# Altium schematic sheet DRAM DDR4.SchDoc (part 1 of 2)
size 594 x 420 mm; Author: ALTIUM GOSTBOM2.0 KEV; SheetNumber: 8; SheetTotal: 48
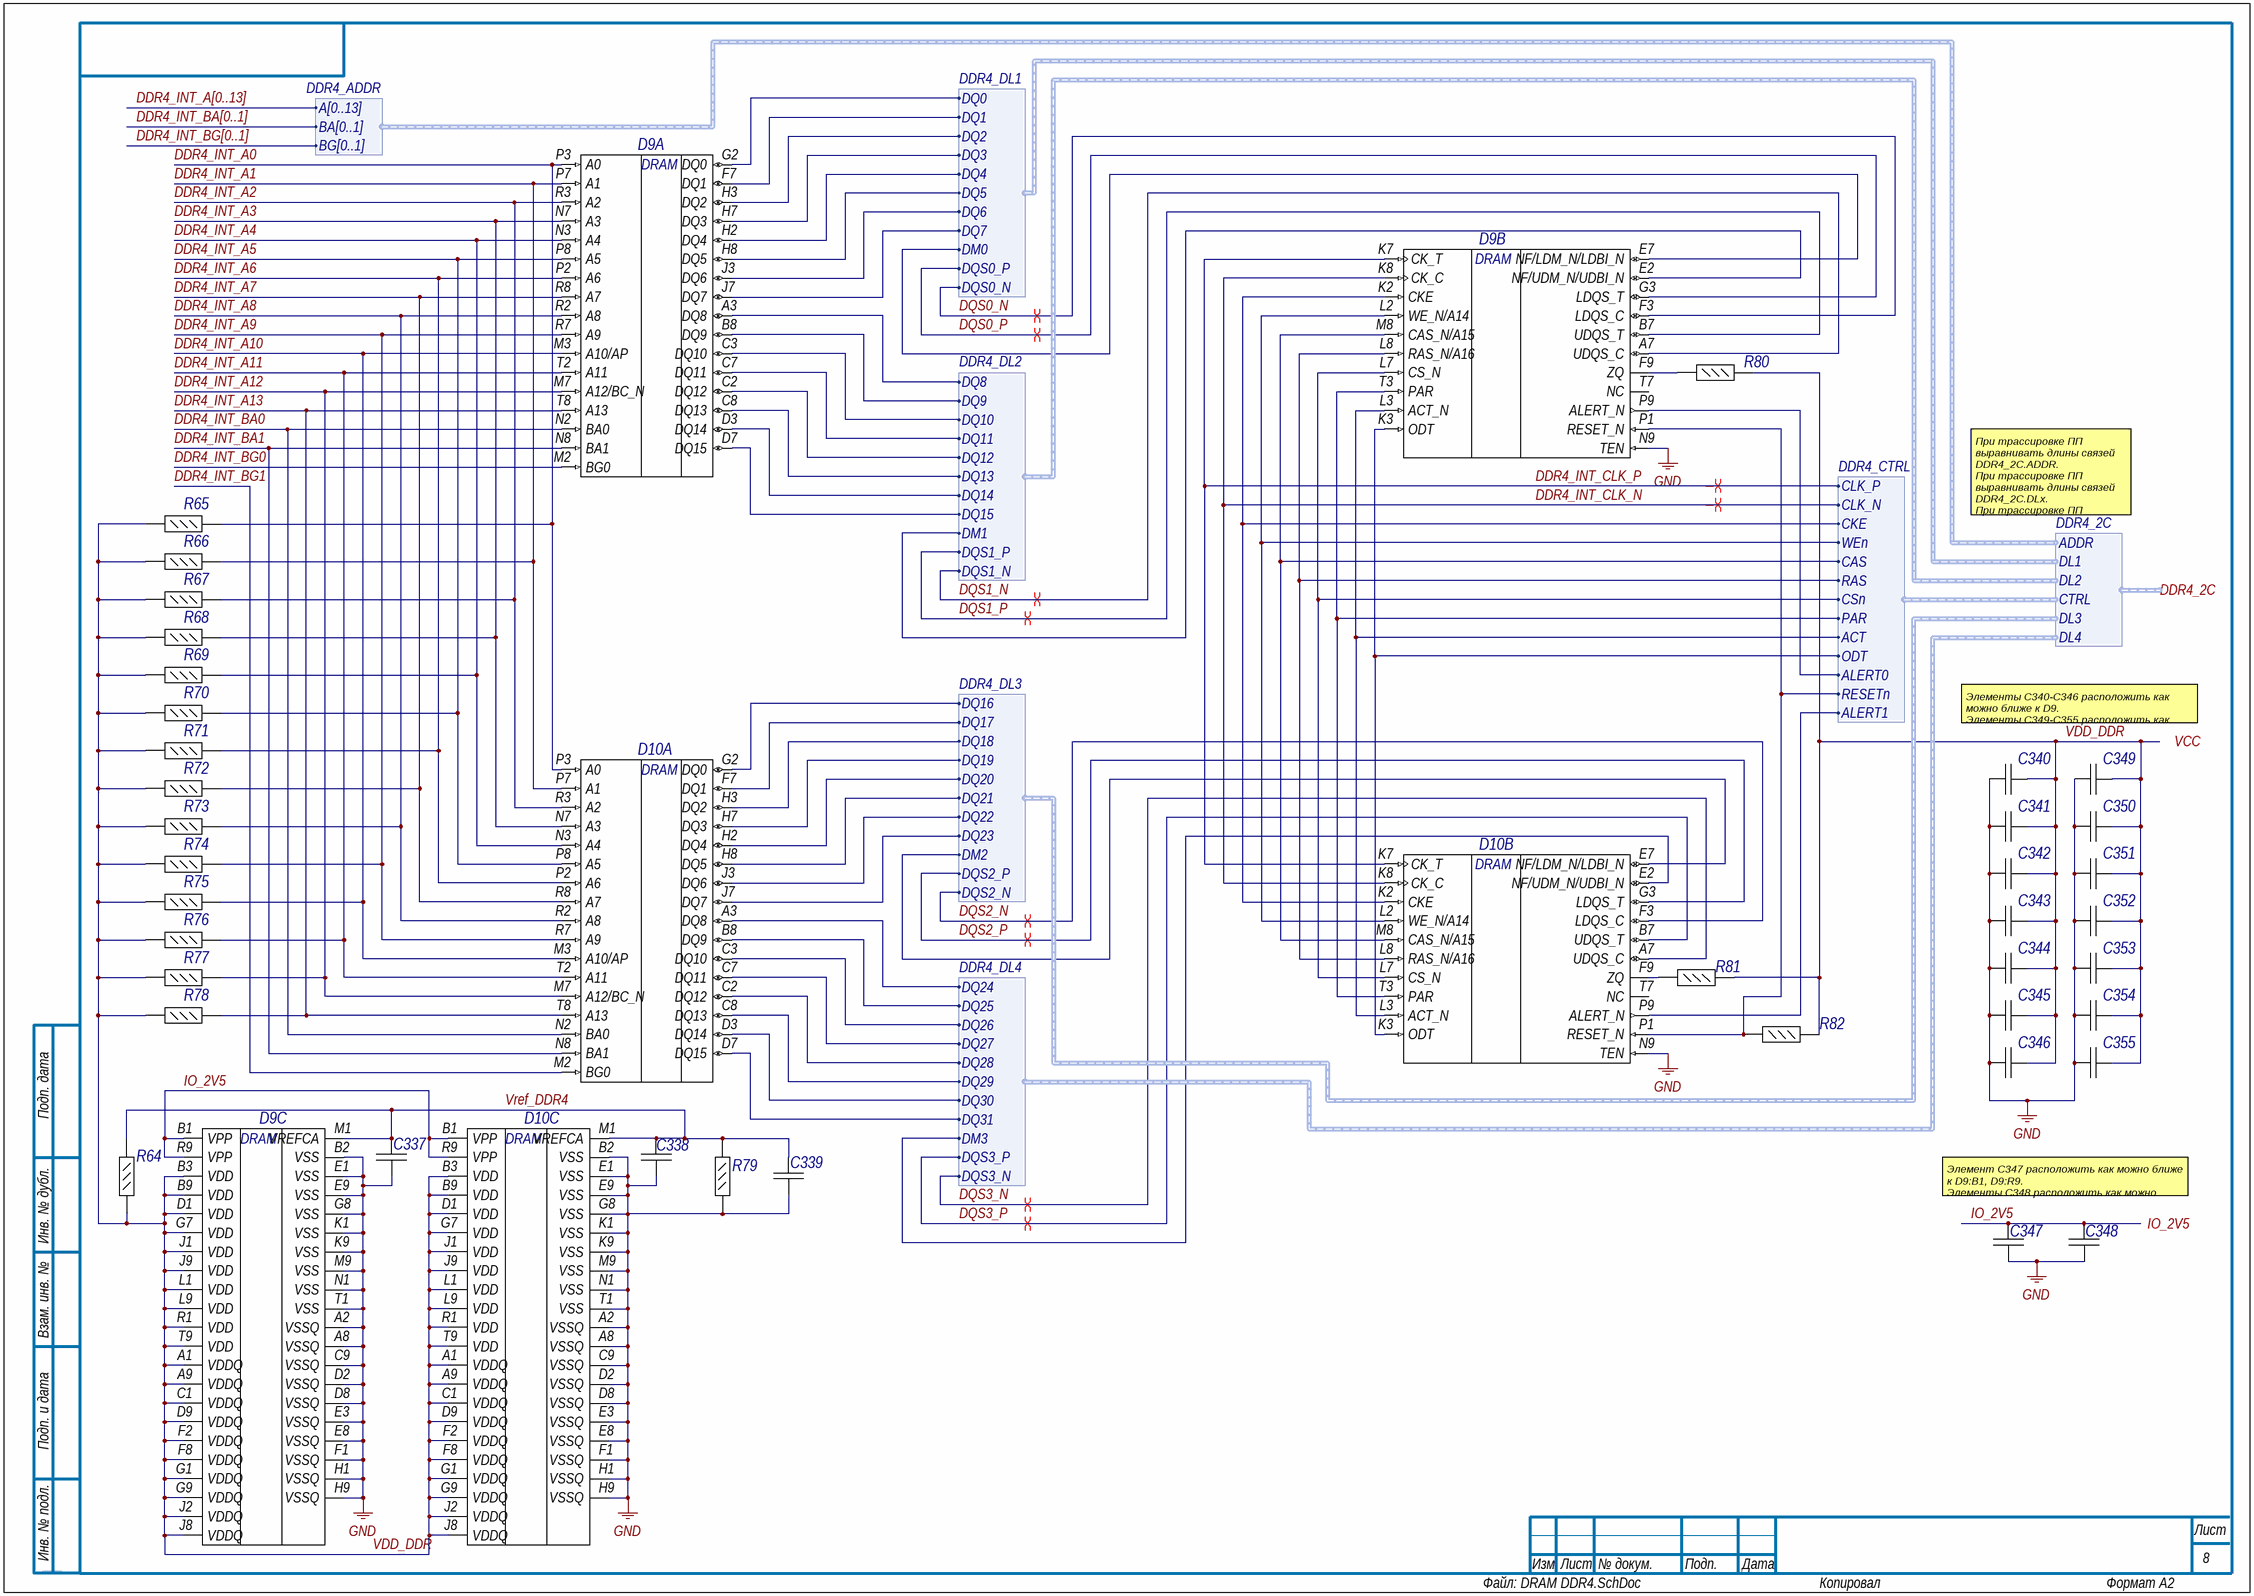
[diagram p0: DRAM DDR4.SchDoc]

## Parts
C337  GRM033R60J104KE19D  [CAPC0603X33X15LL03T05]  (value not drawn)
C338  GRM033R60J104KE19D  [CAPC0603X33X15LL03T05]  (value not drawn)
C339  GRM033R60J104KE19D  [CAPC0603X33X15LL03T05]  (value not drawn)
C340  GRM033R60J104KE19D  [CAPC0603X33X15LL03T05]  (value not drawn)
C341  GRM033R60J104KE19D  [CAPC0603X33X15LL03T05]  (value not drawn)
C342  GRM033R60J104KE19D  [CAPC0603X33X15LL03T05]  (value not drawn)
C343  GRM033R60J104KE19D  [CAPC0603X33X15LL03T05]  (value not drawn)
C344  GRM033R60J104KE19D  [CAPC0603X33X15LL03T05]  (value not drawn)
C345  GRM033R60J104KE19D  [CAPC0603X33X15LL03T05]  (value not drawn)
C346  GRM033R60J104KE19D  [CAPC0603X33X15LL03T05]  (value not drawn)
C347  GRM033R60J104KE19D  [CAPC0603X33X15LL03T05]  (value not drawn)
C348  GRM033R60J104KE19D  [CAPC0603X33X15LL03T05]  (value not drawn)
C349  GRM033R60J104KE19D  [CAPC0603X33X15LL03T05]  (value not drawn)
C350  GRM033R60J104KE19D  [CAPC0603X33X15LL03T05]  (value not drawn)
C351  GRM033R60J104KE19D  [CAPC0603X33X15LL03T05]  (value not drawn)
C352  GRM033R60J104KE19D  [CAPC0603X33X15LL03T05]  (value not drawn)
C353  GRM033R60J104KE19D  [CAPC0603X33X15LL03T05]  (value not drawn)
C354  GRM033R60J104KE19D  [CAPC0603X33X15LL03T05]  (value not drawn)
C355  GRM033R60J104KE19D  [CAPC0603X33X15LL03T05]  (value not drawn)
D9  MT40A512M16LY-107E  [MICT-LY-96_A]  (value not drawn)  (parts A,B,C of 3)
D10  MT40A512M16LY-107E  [MICT-LY-96_A]  (value not drawn)  (parts A,B,C of 3)
R64  ERJ-2RKF2400X  [RESC1005X40X25LL05T05]  (value not drawn)
R65  RC0402JR-0739RL  [RESC1005X40X25LL05T05]  (value not drawn)
R66  RC0402JR-0739RL  [RESC1005X40X25LL05T05]  (value not drawn)
R67  RC0402JR-0739RL  [RESC1005X40X25LL05T05]  (value not drawn)
R68  RC0402JR-0739RL  [RESC1005X40X25LL05T05]  (value not drawn)
R69  RC0402JR-0739RL  [RESC1005X40X25LL05T05]  (value not drawn)
R70  RC0402JR-0739RL  [RESC1005X40X25LL05T05]  (value not drawn)
R71  RC0402JR-0739RL  [RESC1005X40X25LL05T05]  (value not drawn)
R72  RC0402JR-0739RL  [RESC1005X40X25LL05T05]  (value not drawn)
R73  RC0402JR-0739RL  [RESC1005X40X25LL05T05]  (value not drawn)
R74  RC0402JR-0739RL  [RESC1005X40X25LL05T05]  (value not drawn)
R75  RC0402JR-0739RL  [RESC1005X40X25LL05T05]  (value not drawn)
R76  RC0402JR-0739RL  [RESC1005X40X25LL05T05]  (value not drawn)
R77  RC0402JR-0739RL  [RESC1005X40X25LL05T05]  (value not drawn)
R78  RC0402JR-0739RL  [RESC1005X40X25LL05T05]  (value not drawn)
R79  ERJ-2RKF2400X  [RESC1005X40X25LL05T05]  (value not drawn)
R80  ERJ-2RKF2400X  [RESC1005X40X25LL05T05]  (value not drawn)
R81  ERJ-2RKF2400X  [RESC1005X40X25LL05T05]  (value not drawn)
R82  ERJ-2RKF2001X  [RESC1005X40X25LL05T05]  (value not drawn)

## Ports
DDR4_2C (harness DDR4_2C), IO_2V5, VCC

## Harnesses
DDR4_CTRL: CLK_P, CLK_N, CKE, WEn, CAS, RAS, CSn, PAR, ACT, ODT, ALERT0, RESETn, ALERT1
DDR4_ADDR: A[0..13], BA[0..1], BG[0..1]
DDR4_DL1: DQ0, DQ1, DQ2, DQ3, DQ4, DQ5, DQ6, DQ7, DM0, DQS0_P, DQS0_N
DDR4_DL2: DQ8, DQ9, DQ10, DQ11, DQ12, DQ13, DQ14, DQ15, DM1, DQS1_P, DQS1_N
DDR4_DL3: DQ16, DQ17, DQ18, DQ19, DQ20, DQ21, DQ22, DQ23, DM2, DQS2_P, DQS2_N
DDR4_DL4: DQ24, DQ25, DQ26, DQ27, DQ28, DQ29, DQ30, DQ31, DM3, DQS3_P, DQS3_N
DDR4_2C: ADDR, CTRL, DL1, DL2, DL3, DL4

## Nets
GND: C337.1 C338.1 C339.1 C340.1 C341.1 C342.1 C343.1 C344.1 C345.1 C346.1 C347.1 C348.1 C349.1 C350.1 C351.1 C352.1 C353.1 C354.1 C355.1 D9.A2(VSSQ) D9.A8(VSSQ) D9.B2(VSS) D9.C9(VSSQ) D9.D2(VSSQ) D9.D8(VSSQ) D9.E1(VSS) D9.E3(VSSQ) D9.E8(VSSQ) D9.E9(VSS) D9.F1(VSSQ) D9.G8(VSS) D9.H1(VSSQ) D9.H9(VSSQ) D9.K1(VSS) D9.K9(VSS) D9.M9(VSS) D9.N1(VSS) D9.N9(TEN) D9.T1(VSS) D10.A2(VSSQ) D10.A8(VSSQ) D10.B2(VSS) D10.C9(VSSQ) D10.D2(VSSQ) D10.D8(VSSQ) D10.E1(VSS) D10.E3(VSSQ) D10.E8(VSSQ) D10.E9(VSS) D10.F1(VSSQ) D10.G8(VSS) D10.H1(VSSQ) D10.H9(VSSQ) D10.K1(VSS) D10.K9(VSS) D10.M9(VSS) D10.N1(VSS) D10.N9(TEN) D10.T1(VSS) R79.1
DDR4_INT_A0: D9.P3(A0) D10.P3(A0) R65.2
DDR4_INT_A1: D9.P7(A1) D10.P7(A1) R66.2
DDR4_INT_A2: D9.R3(A2) D10.R3(A2) R67.2
DDR4_INT_A3: D9.N7(A3) D10.N7(A3) R68.2
DDR4_INT_A4: D9.N3(A4) D10.N3(A4) R69.2
DDR4_INT_A5: D9.P8(A5) D10.P8(A5) R70.2
DDR4_INT_A6: D9.P2(A6) D10.P2(A6) R71.2
DDR4_INT_A7: D9.R8(A7) D10.R8(A7) R72.2
DDR4_INT_A8: D9.R2(A8) D10.R2(A8) R73.2
DDR4_INT_A9: D9.R7(A9) D10.R7(A9) R74.2
DDR4_INT_A10: D9.M3(A10/AP) D10.M3(A10/AP) R75.2
DDR4_INT_A11: D9.T2(A11) D10.T2(A11) R76.2
DDR4_INT_A12: D9.M7(A12/BC_N) D10.M7(A12/BC_N) R77.2
DDR4_INT_A13: D9.T8(A13) D10.T8(A13) R78.2
DDR4_INT_BA0: D9.N2(BA0) D10.N2(BA0)
DDR4_INT_BA1: D9.N8(BA1) D10.N8(BA1)
DDR4_INT_BG0: D9.M2(BG0)
DDR4_INT_BG1: D10.M2(BG0)
DDR4_INT_CLK_N: D9.K8(CK_C) D10.K8(CK_C) ; harness DDR4_CTRL.CLK_N
DDR4_INT_CLK_P: D9.K7(CK_T) D10.K7(CK_T) ; harness DDR4_CTRL.CLK_P
DQS0_N: D9.F3(LDQS_C) ; harness DDR4_DL1.DQS0_N
DQS0_P: D9.G3(LDQS_T) ; harness DDR4_DL1.DQS0_P
DQS1_N: D9.A7(UDQS_C) ; harness DDR4_DL2.DQS1_N
DQS1_P: D9.B7(UDQS_T) ; harness DDR4_DL2.DQS1_P
DQS2_N: D10.F3(LDQS_C) ; harness DDR4_DL3.DQS2_N
DQS2_P: D10.G3(LDQS_T) ; harness DDR4_DL3.DQS2_P
DQS3_N: D10.A7(UDQS_C) ; harness DDR4_DL4.DQS3_N
DQS3_P: D10.B7(UDQS_T) ; harness DDR4_DL4.DQS3_P
IO_2V5: C347.2 C348.2 D9.B1(VPP) D9.R9(VPP) D10.B1(VPP) D10.R9(VPP) ; port IO_2V5
VDD_DDR: C340.2 C341.2 C342.2 C343.2 C344.2 C345.2 C346.2 C349.2 C350.2 C351.2 C352.2 C353.2 C354.2 C355.2 D9.A1(VDDQ) D9.A9(VDDQ) D9.B3(VDD) D9.B9(VDD) D9.C1(VDDQ) D9.D1(VDD) D9.D9(VDDQ) D9.F2(VDDQ) D9.F8(VDDQ) D9.G1(VDDQ) D9.G7(VDD) D9.G9(VDDQ) D9.J1(VDD) D9.J2(VDDQ) D9.J8(VDDQ) D9.J9(VDD) D9.L1(VDD) D9.L9(VDD) D9.R1(VDD) D9.T9(VDD) D10.A1(VDDQ) D10.A9(VDDQ) D10.B3(VDD) D10.B9(VDD) D10.C1(VDDQ) D10.D1(VDD) D10.D9(VDDQ) D10.F2(VDDQ) D10.F8(VDDQ) D10.G1(VDDQ) D10.G7(VDD) D10.G9(VDDQ) D10.J1(VDD) D10.J2(VDDQ) D10.J8(VDDQ) D10.J9(VDD) D10.L1(VDD) D10.L9(VDD) D10.R1(VDD) D10.T9(VDD) R64.1 R65.1 R66.1 R67.1 R68.1 R69.1 R70.1 R71.1 R72.1 R73.1 R74.1 R75.1 R76.1 R77.1 R78.1 R80.2 R81.2 R82.2 ; port VCC
Vref_DDR4: C337.2 C338.2 C339.2 D9.M1(VREFCA) D10.M1(VREFCA) R64.2 R79.2
NetD9_A3: D9.A3(DQ8) ; harness DDR4_DL2.DQ8
NetD9_B8: D9.B8(DQ9) ; harness DDR4_DL2.DQ9
NetD9_C2: D9.C2(DQ12) ; harness DDR4_DL2.DQ12
NetD9_C3: D9.C3(DQ10) ; harness DDR4_DL2.DQ10
NetD9_C7: D9.C7(DQ11) ; harness DDR4_DL2.DQ11
NetD9_C8: D9.C8(DQ13) ; harness DDR4_DL2.DQ13
NetD9_D3: D9.D3(DQ14) ; harness DDR4_DL2.DQ14
NetD9_D7: D9.D7(DQ15) ; harness DDR4_DL2.DQ15
NetD9_E2: D9.E2(NF/UDM_N/UDBI_N) ; harness DDR4_DL2.DM1
NetD9_E7: D9.E7(NF/LDM_N/LDBI_N) ; harness DDR4_DL1.DM0
NetD9_F7: D9.F7(DQ1) ; harness DDR4_DL1.DQ1
NetD9_F9: D9.F9(ZQ) R80.1
NetD9_G2: D9.G2(DQ0) ; harness DDR4_DL1.DQ0
NetD9_H2: D9.H2(DQ4) ; harness DDR4_DL1.DQ4
NetD9_H3: D9.H3(DQ2) ; harness DDR4_DL1.DQ2
NetD9_H7: D9.H7(DQ3) ; harness DDR4_DL1.DQ3
NetD9_H8: D9.H8(DQ5) ; harness DDR4_DL1.DQ5
NetD9_J3: D9.J3(DQ6) ; harness DDR4_DL1.DQ6
NetD9_J7: D9.J7(DQ7) ; harness DDR4_DL1.DQ7
NetD9_K2: D9.K2(CKE) D10.K2(CKE) ; harness DDR4_CTRL.CKE
NetD9_K3: D9.K3(ODT) D10.K3(ODT) ; harness DDR4_CTRL.ODT
NetD9_L2: D9.L2(WE_N/A14) D10.L2(WE_N/A14) ; harness DDR4_CTRL.WEn
NetD9_L3: D9.L3(ACT_N) D10.L3(ACT_N) ; harness DDR4_CTRL.ACT
NetD9_L7: D9.L7(CS_N) D10.L7(CS_N) ; harness DDR4_CTRL.CSn
NetD9_L8: D9.L8(RAS_N/A16) D10.L8(RAS_N/A16) ; harness DDR4_CTRL.RAS
NetD9_M8: D9.M8(CAS_N/A15) D10.M8(CAS_N/A15) ; harness DDR4_CTRL.CAS
NetD9_P1: D9.P1(RESET_N) D10.P1(RESET_N) R82.1 ; harness DDR4_CTRL.RESETn
NetD9_P9: D9.P9(ALERT_N) ; harness DDR4_CTRL.ALERT0
NetD9_T3: D9.T3(PAR) D10.T3(PAR) ; harness DDR4_CTRL.PAR
NetD10_A3: D10.A3(DQ8) ; harness DDR4_DL4.DQ24
NetD10_B8: D10.B8(DQ9) ; harness DDR4_DL4.DQ25
NetD10_C2: D10.C2(DQ12) ; harness DDR4_DL4.DQ28
NetD10_C3: D10.C3(DQ10) ; harness DDR4_DL4.DQ26
NetD10_C7: D10.C7(DQ11) ; harness DDR4_DL4.DQ27
NetD10_C8: D10.C8(DQ13) ; harness DDR4_DL4.DQ29
NetD10_D3: D10.D3(DQ14) ; harness DDR4_DL4.DQ30
NetD10_D7: D10.D7(DQ15) ; harness DDR4_DL4.DQ31
NetD10_E2: D10.E2(NF/UDM_N/UDBI_N) ; harness DDR4_DL4.DM3
NetD10_E7: D10.E7(NF/LDM_N/LDBI_N) ; harness DDR4_DL3.DM2
NetD10_F7: D10.F7(DQ1) ; harness DDR4_DL3.DQ17
NetD10_F9: D10.F9(ZQ) R81.1
NetD10_G2: D10.G2(DQ0) ; harness DDR4_DL3.DQ16
NetD10_H2: D10.H2(DQ4) ; harness DDR4_DL3.DQ20
NetD10_H3: D10.H3(DQ2) ; harness DDR4_DL3.DQ18
NetD10_H7: D10.H7(DQ3) ; harness DDR4_DL3.DQ19
NetD10_H8: D10.H8(DQ5) ; harness DDR4_DL3.DQ21
NetD10_J3: D10.J3(DQ6) ; harness DDR4_DL3.DQ22
NetD10_J7: D10.J7(DQ7) ; harness DDR4_DL3.DQ23
NetD10_P9: D10.P9(ALERT_N) ; harness DDR4_CTRL.ALERT1

Not connected (* = marked no-connect by the designer): D9 T7(NC); D10 T7(NC)

## Buses and harness runs
bus DDR4_INT_A[0..13]
bus DDR4_INT_BA[0..1]
bus DDR4_INT_BG[0..1]

## Layout directives
differential pair: DDR4_INT_CLK_N, DDR4_INT_CLK_P, DQS0_N, DQS0_P, DQS1_N, DQS1_P, DQS2_N, DQS2_P, DQS3_N, DQS3_P

## Notes on the sheet
- При трассировке ПП выравнивать длины связей DDR4_2C.ADDR.
  При трассировке ПП выравнивать длины связей DDR4_2C.DLx.
  При трассировке ПП выравнивать длины связей DDR4_2C.CTRL.
- Элементы C340-C346 расположить как можно ближе к D9.
  Элементы C349-C355 расположить как можно ближе к D10.
- Элемент C347 расположить как можно ближе к D9:B1, D9:R9.
  Элементы C348 расположить как можно ближе к D10:B1, D10:R9.
- Подп. дата
- Инв. № дубл.
- Взам. инв. №
- Подп. и дата
- Инв. № подл.
- Изм.
- Лист
- № докум.
- Подп.
- Дата
- ALTIUM GOSTBOM2.0 KEV
- Файл:
- Копировал
- Формат А2
- (in symbol E114, part A) DRAM
- (in symbol E114, part B) DRAM
- (in symbol E114, part C) DRAM